# Altium schematic sheet 02 - IRF530.SchDoc
size A4; SheetNumber: 3; SheetTotal: 3
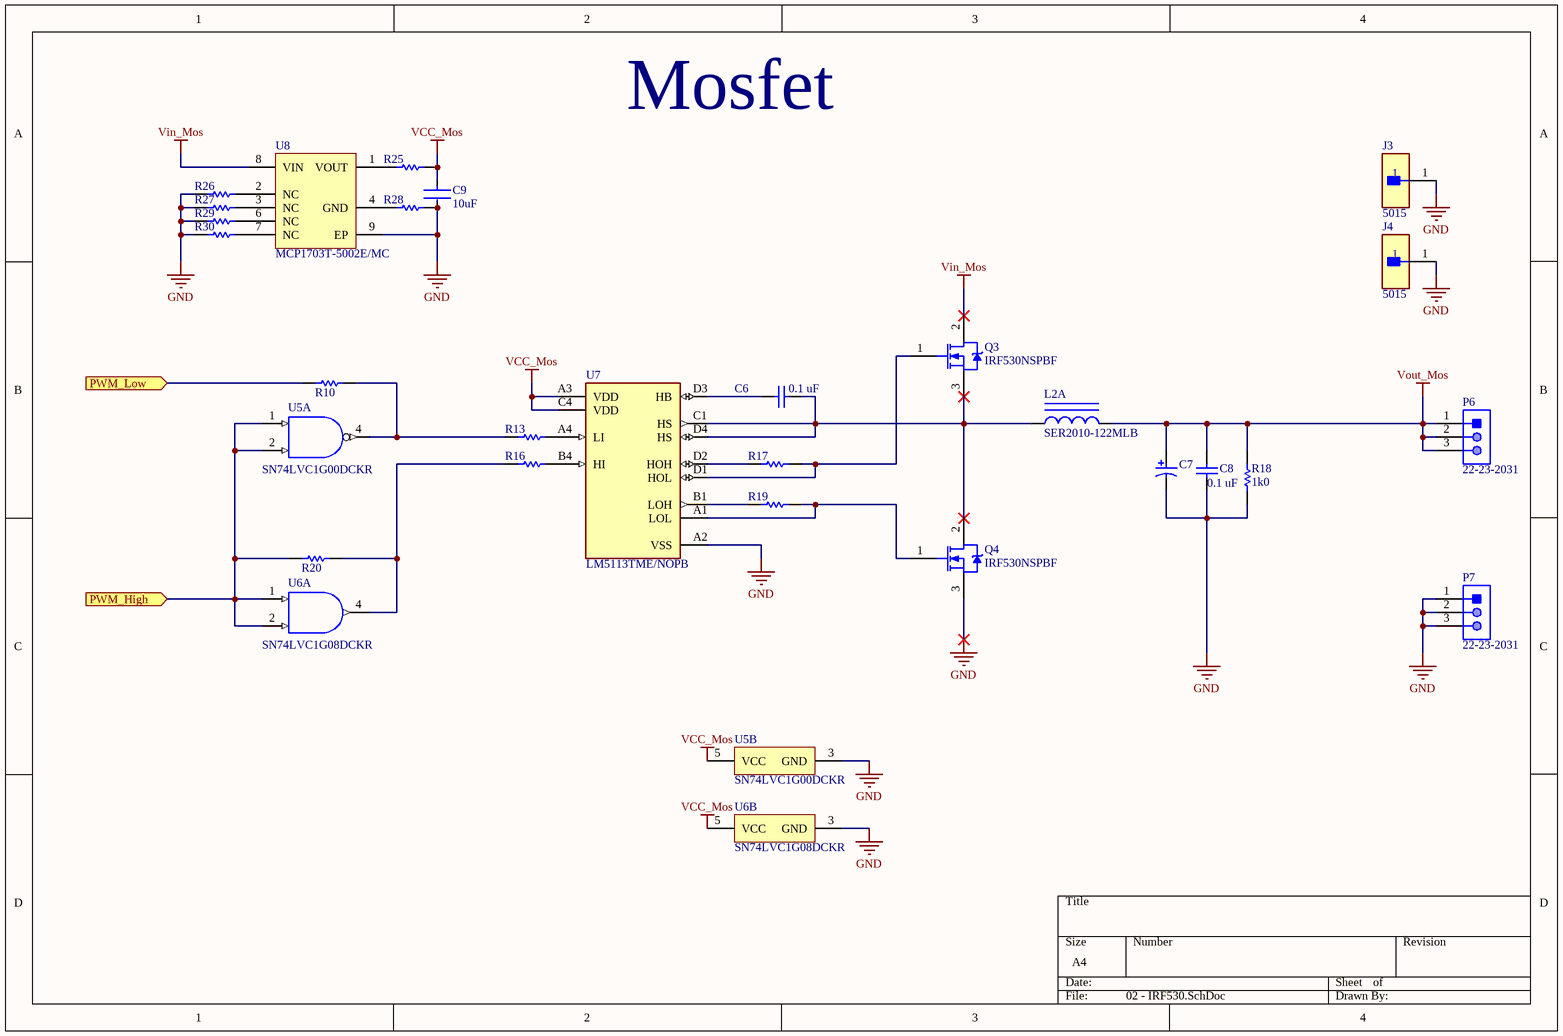
[diagram p0: 02 - IRF530.SchDoc]

## Parts
C6  0.1 uF  [CAPC2013X94X50ML20T25]
C7  EEEFK1J470P  [PNSC-FK-V-F_V]  (value not drawn)
C8  0.1 uF  [CAPC2013X94X50ML20T25]
C9  10uF  [FP-C0805C-DG-MFG]
J3  5015  [FP-5015-MFG]
J4  5015  [FP-5015-MFG]
L2  SER2010-122MLB  [COIL-SER2010-3_V]  (part A of 2)
P6  22-23-2031  [MOLX-22-23-2031_V]
P7  22-23-2031  [MOLX-22-23-2031_V]
Q3  IRF530NSPBF  [INTR-D2PAK-3_V]
Q4  IRF530NSPBF  [INTR-D2PAK-3_V]
R10  CRCW02010000Z0ED  [RESC0603X28X15NL5T05]  (value not drawn)
R13  CRCW02010000Z0ED  [RESC0603X28X15NL5T05]  (value not drawn)
R16  CRCW02010000Z0ED  [RESC0603X28X15NL5T05]  (value not drawn)
R17  CRCW02010000Z0ED  [RESC0603X28X15NL5T05]  (value not drawn)
R18  Valor/Partnumber: 1k0  [0805]  (hidden comment: 1k0 SMD 0805)
R19  CRCW02010000Z0ED  [RESC0603X28X15NL5T05]  (value not drawn)
R20  CRCW02010000Z0ED  [RESC0603X28X15NL5T05]  (value not drawn)
R25  CRCW02010000Z0ED  [RESC0603X28X15NL5T05]  (value not drawn)
R26  CRCW02010000Z0ED  [RESC0603X28X15NL5T05]  (value not drawn)
R27  CRCW02010000Z0ED  [RESC0603X28X15NL5T05]  (value not drawn)
R28  CRCW02010000Z0ED  [RESC0603X28X15NL5T05]  (value not drawn)
R29  CRCW02010000Z0ED  [RESC0603X28X15NL5T05]  (value not drawn)
R30  CRCW02010000Z0ED  [RESC0603X28X15NL5T05]  (value not drawn)
U5  SN74LVC1G00DCKR  [DCK0005A_M]  (parts A,B of 2)
U6  SN74LVC1G08DCKR  [DCK0005A_M]  (parts A,B of 2)
U7  LM5113TME/NOPB  [FP-YFX0012-MFG]
U8  MCP1703T-5002E/MC  [DFN-MC8]

## Ports
PWM_High (in), PWM_Low (in)

## Nets
GND: C7.2 C8.1 C9.2 J3.1 J4.1 P7.1 P7.2 P7.3 Q4.3(S) R18.1 R26.1 R27.1 R28.2 R29.1 R30.1 U5.3(GND) U6.3(GND) U7.A2(VSS) U8.9(EP)
VCC_Mos: C9.1 R25.2 U5.5(VCC) U6.5(VCC) U7.A3(VDD) U7.C4(VDD)
Vin_Mos: Q3.2(D) U8.8(VIN)
Vout_Mos: C7.1 C8.2 L2.2 P6.1 P6.2 P6.3 R18.2
PWM_High: R20.2 U5.1(A) U5.2(B) U6.1(A) U6.2(B) ; port PWM_High
PWM_Low: R10.2 ; port PWM_Low
NetC6_1: C6.1 U7.D3(HB)
NetC6_2: C6.2 L2.1 Q3.3(S) Q4.2(D) U7.C1(HS) U7.D4(HS)
NetQ3_1: Q3.1(G) R17.2 U7.D1(HOL)
NetQ4_1: Q4.1(G) R19.2 U7.A1(LOL)
NetR10_1: R10.1 R13.1 U5.4(Y)
NetR13_2: R13.2 U7.A4(LI)
NetR16_1: R16.1 R20.1 U6.4(Y)
NetR16_2: R16.2 U7.B4(HI)
NetR17_1: R17.1 U7.D2(HOH)
NetR19_1: R19.1 U7.B1(LOH)
NetR25_1: R25.1 U8.1(VOUT)
NetR26_2: R26.2 U8.2(NC)
NetR27_2: R27.2 U8.3(NC)
NetR28_1: R28.1 U8.4(GND)
NetR29_2: R29.2 U8.6(NC)
NetR30_2: R30.2 U8.7(NC)

## Notes on the sheet
- Mosfet

## Library data of the parts
C6 C8 = CMP-2000-05016-1: Chip Capacitor, Ceramic, 0.1 uF, 10%, 50 V, 0805, RoHS, Tape and Reel; Manufacturer: AVX; Rated Voltage: 50V; Capacitance: 100nF; Dielectric: X7R; Case Size/Dimension: 0805; Tolerance (%): ±10%; Datasheet URL: http://www.farnell.com/datasheets/319609.pdf; Datasheet Version: Sep-07; Manufacturer URL: http://www.avx.com/
C7 = CMP-2000-06210-1: Aluminum Electrolytic Capacitor, 47 uF, +/- 20%, 63 V, 2-Pin SMD (Size Code F), -55 to 105 degC, RoHS, Tape and Reel; Manufacturer: Panasonic; External Length / Height: 10.2mm; Power Factor: 0.08; AE Capacitor Case: RadialCan-SMD; Operating Lifetime: 2000h; Voltage Rating: 63V; SVHC: NoSVHC(16-Dec-2013); Life Time @ Temperature: 2000hours@105°C; Ripple Current AC: 250mA; Ripple Current Frequency: 100kHz; Power Factor Frequency: 120Hz; Capacitance: 47µF; Impedance: 0.65ohm; Product Range: PANASONIC-FKSeries; Ripple Current Temperature: 105°C; Package Description: 2-Pin Electrolytic Aluminum Capacitor, Body 8.3 x 8.3 mm; Package Reference: FK-V-F; Mounting Technology: SurfaceMount; Operating Temperature Min: -55°C; Capacitor Case Style: SMD; Datasheet URL: http://industrial.panasonic.com/cdbs/www-data/pdf/RDE0000/ABA0000C1181.pdf; Package / Case: F; Capacitance Tolerance ±: ±20%; Packaging: CutTape; Operating Temperature Max: 105°C; Voltage Rating V DC: 63V; Datasheet Version: 03/2016; Tolerance +: 20%; Diameter: 8mm; Tolerance -: 20%; Capacitor Terminals: SMD; Manufacturer URL: http://www.panasonic.com/; Operating life Time: 2000h; Lifetime @ Temperature: 2000hours@105°C; Package URL: http://industrial.panasonic.com/cdbs/www-data/pdf/RDE0000/DME0000COL48.pdf; Height: 10.2mm; Operating Temperature Range: -55°Cto+105°C; Series: FK; Capacitance Tolerance: ±20%
C9 = CMP-2007-03243-2: CAP CER 10UF 10V X5R 0805; Manufacturer Part Number: C0805C106K8PACTU; Manufacturer: Kemet; 3DS Part Number: 220-00001; Tolerance: 10%; Temperature Coefficient: 15%; Material: Ceramic; Device Class L2: Capacitors; Device Class L1: Passive Components; ComponentLink2URL: https://content.kemet.com/datasheets/KEM_C1006_X5R_SMD.pdf; Height: 1.4mm; Lead Free: Yes; Digikey Description: CAP CER 10UF 10V X5R 0805; Octopart: https://octopart.com/c0805c106k8pactu-kemet-98697; Capacitance: 10uF; Value: 10uF; Temperature Range Low: -55°C; Temperature: -55°C to +85°C; Automotive: No; Mouser Description: CAP CER 10UF 10V X5R 0805; Ipc Land Pattern Name: CAPC200125X125; Temperature Range High: +85°C; Voltage: 10V; RoHS: TRUE; Device Class L3: Ceramic Capacitors; ComponentLink2Description: Datasheet; Voltage Rating: 10V; Package: C0805C-DG; Temperature Characteristic: X5R; Category: Cap
J3 J4 = CMP-2000-05183-2: PC TEST POINT MINIATURE; Manufacturer: keystone; Number Of Contacts: 1; Conn Orientation: Straight; Category: Conn; Manufacturer Part Number: 5015; Digikey Description: PC TEST POINT MINIATURE; Automotive: No; Lead Free: Yes; Octopart: https://octopart.com/5015-keystone-3822; ComponentLink2URL: http://www.keyelco.com/product-pdf.cfm?p=1353; Package: 5015; RoHS: TRUE; Device Class L3: unset; Device Class L2: unset; Contact Material: Silver; Device Class L1: Connectors; Height: 1.65mm; ComponentLink2Description: Datasheet
L2 = CMP-0837-00016-1: Shielded Power Inductor, 1.2 uH, +/- 20%, 0.9 mOhm, 69 MHz, 37 A, -40 to 125 degC, 3-Pin SMD, RoHS; Manufacturer: Coilcraft; Isat (A): 37; Inductance +/- 20% (uH): 1.2; Packing: Less than full reel; DCR typ (mOhm): 0.9; SRF typ (MHz): 69; ComponentLink3Description: Package Specification; DatasheetVersion: 09/2012; ComponentLink2Description: Datasheet; ComponentLink3URL: http://www.coilcraft.com/pdfs/ser2000.pdf; Ambient Temperature with Irms Current: -40 to 85 degC; Ambient Temperature with Derated Current: 85 to 125 degC; PartNumber: SER2010-122MLB; RoHS: TRUE; Mounting Technology: Surface Mount; ComponentLink1Description: Manufacturer URL; PackageReference: SER2010-3; ComponentLink2URL: http://www.coilcraft.com/pdfs/ser2000.pdf; ComponentLink1URL: http://www.coilcraft.com/; PackageVersion: 09/2012; PackageDescription: 3-Pin SMD, Body 19.18 x 9.27 mm, Height 9.4 mm
P6 P7 = CMP-2000-05242-1: Male Header, Pitch 2.54 mm, 1 x 3 Position, Height 8.18 mm, Tail Length 3.56 mm, RoHS, Bulk; Current Rating: 4A; Brand: Molex; Pitch: 2.54mm; Voltage Rating: 250V; Mounting Angle: Vertical; Type: Locking; Factory Pack Quantity: 16000; Tradename: KK; Housing Material: Nylon; Contact Material: Brass; Manufacturer URL: http://www.molex.com/; Termination Style: ThroughHole; Mounting Style: ThroughHole; Number of Positions: 3Position; Contact Gender: Pin(Male); Packaging: Bulk; Series: 6373; Datasheet Version: Sep-01; Contact Plating: Tin; Product: Headers; Datasheet URL: https://datasheet.ciiva.com/19472/232274-19472863.pdf; RoHS: Details; Product Category: Headers&WireHousings; Manufacturer: Molex; Number of Rows: 1Row
Q3 Q4 = CMP-2000-06460-1: HEXFET(R) Power MOSFET, 17 A, 90 mOhm, 100 V, -55 to 175 degC, 3-Pin D2PAK, Pb-Free, Tube; Manufacturer: International Rectifier; Channel Type: N-Channel; Drain-to-Source Voltage [Vdss]: 100V; Rated Power Dissipation: 70W; Qg Gate Charge: 37nC; Drain-Source On Resistance-Max: 90mO; Datasheet URL: http://www.infineon.com/dgdl/irf530nspbf.pdf?fileId=5546d462533600a4015355e38eb4199c; Manufacturer URL: http://internationalrectifier.com/; Package Description: 3-Pin Transistor Outline, Body 10.16 x 9.08 mm, Pitch 2.54 mm; Package Reference: D2PAK-3; Mounting Technology: SurfaceMount; Datasheet Version: 03/2004
R10 R13 R16 R17 R19 R20 R25-R30 = CMP-2004-00001-2: Chip Resistor, 0 Ohm, Jumper, 0.05 W, -55 to 155 degC, 0201 (0603 Metric), RoHS, Tape and Reel; Voltage Rating: 30 V; Case\Package: 0201; Resistance: 0 mohm; Tolerance: 5%; Power Rating: 50 mW; REACH SVHC: Unknown; Length: 0.6 mm; Packaging: Cut Tape; Weight: 6E-06 oz; ComponentLink2URL: http://www.vishay.com/docs/20052/crcw0201e3.pdf; Mounting Technology: Surface Mount; Case Code (Imperial): 0201; Radiation Hardening: No; RoHSCompliant: true; Package Quantity: 1; Min Operating Temperature: -55 degC; Height: 0.23 mm; PackageReference: 0201; ComponentLink1Description: Manufacturer URL; ComponentLink2Description: Datasheet; Case Code (Metric): 0603; DatasheetVersion: 03/2016; Width: 0.3 mm; Mount: Surface Mount; PackageDescription: 2-Pin Surface Mount Device, Body 0.6 x 0.3 mm; ComponentLink1URL: http://www.vishay.com/; Max Operating Temperature: 155 degC
R18 = 1k0 SMD 0805: Resistor SMD 0805 1/8W; Tolerância: 5%; Potência: 1/8W; Montagem: SMD
U5 = CMP-0859-00364-3: Single 2 Input Positive NAND Gate, DCK0005A, LARGE T&R; Manufacturer: Texas Instruments; Output Type: CMOS; ICC @ Nom Voltage(Max)(mA): 0.01; 3-State Output: No; Input Type: CMOS/TTL; VCC(Min)(V): 1.65; Technology Family: LVC; Bits(#): 1; Output Drive (IOL/IOH)(Max)(mA): 32/-32; F @ Nom Voltage(Max)(Mhz): 150; Voltage(Nom)(V): 1.8,2.5,3.3,5; Logic: True; Rating: Catalog; tpd @ Nom Voltage(Max)(ns): 9,5.5,4.7,4; VCC(Max)(V): 5.5; Gate Type: NAND; DatasheetVersion: SCES212AB; PackageReference: DCK0005A; Sub-Family: NAND Gate; Operating Temperature Range(C): -40 to 125,-40 to 85; Generic Part Number: SN74LVC1G00; Schmitt Trigger: No
U6 = CMP-0859-00266-3: Single 2-Input Positive-AND Gate, DCK0005A, LARGE T&R; Manufacturer: Texas Instruments; tpd @ Nom Voltage(Max)(ns): 4.5,6,4,5; F @ Nom Voltage(Max)(Mhz): 150; ICC @ Nom Voltage(Max)(mA): 0.01; Bits(#): 1; VCC(Min)(V): 1.65; Gate Type: AND; Rating: Catalog; Output Type: CMOS; Voltage(Nom)(V): 1.8,2.5,3.3,5; Technology Family: LVC; VCC(Max)(V): 5.5; Input Type: CMOS/TTL; Schmitt Trigger: No; Output Drive (IOL/IOH)(Max)(mA): 32/-32; Logic: True; Generic Part Number: SN74LVC1G08; DatasheetVersion: SCES217Y; Sub-Family: AND Gate; 3-State Output: No; Operating Temperature Range(C): -40 to 125,-40 to 85; PackageReference: DCK0005A
U7 = CMP-04912-000040-1: IC GATE DRVR HALF-BRIDGE 12DSBGA; Turn-On Delay Time: 28ns; Number of Drivers: 2; Turn-Off Delay Time: 26.5ns; Max Output Current: 5A; Rise Time: 7ns; Fall Time: 1.5ns; Min Supply Voltage: 4.5V; Max Supply Voltage: 5.5V; Operating Supply Current: 2mA; RoHS Compliant: Yes; REACH SVHC: No SVHC; Lead Free: Lead Free; Number of Outputs: 2; Packaging: Tape and Reel; Number of Channels: 2; Max Operating Temperature: 125°C; Min Operating Temperature: -40°C; Mount: Surface Mount; Output Current: 5A; Series: LM5113; Package Quantity: 250; Number of Pins: 12
U8 = CMP-0136-00281-1: 250 mA, 16V, Low Quiescent Current LDO Regulator, 8-Pin DFN, Extended Temperature, Tape and Reel; PackageDescription: 8-Lead Plastic Dual Flat, No Lead Package (MC) - 2x3x0.9mm Body [DFN]; PackageReference: DFN-MC8; PackageVersion: revBB, Aug-2009; DatasheetVersion: revD, Sep-2009